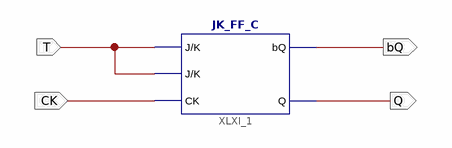
[diagram p0: schematic sheet 1]
// Xilinx ISE schematic T_FF_C1.sch (spartan6) as structural Verilog: 1 symbols, 4 ports
module T_FF_C1 (
  input  T,
  input  CK,
  output bQ,
  output Q
);

  JK_FF_C XLXI_1 (.J(T), .K(T), .CK(CK), .bQ(bQ), .Q(Q));
endmodule
